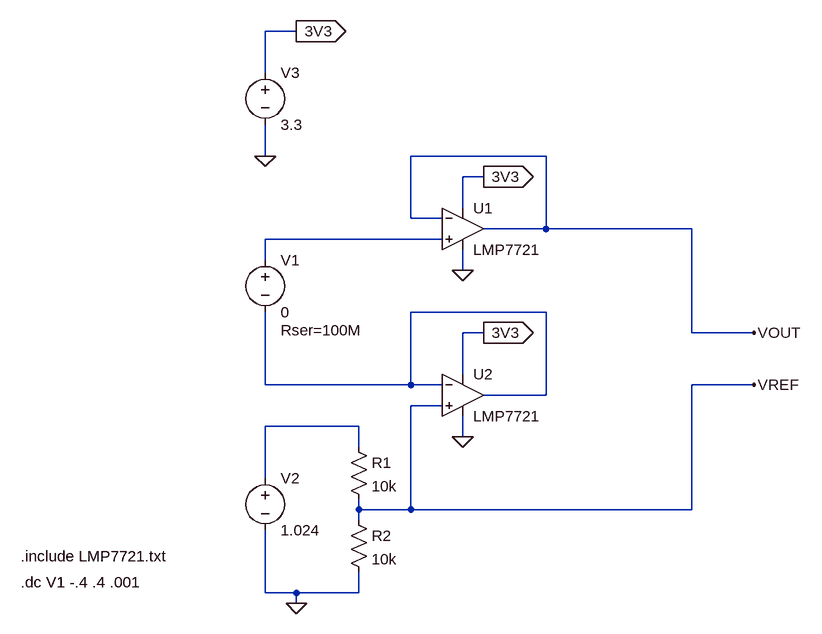
[diagram p0: schematic phMeter.asc]
phMeter.asc, the LTspice schematic file:
Version 4
SHEET 1 880 680
WIRE 48 -240 0 -240
WIRE 0 -176 0 -240
WIRE 0 -48 0 -96
WIRE 432 -48 224 -48
WIRE 336 -16 304 -16
WIRE 304 32 304 -16
WIRE 224 48 224 -48
WIRE 272 48 224 48
WIRE 432 64 432 -48
WIRE 432 64 336 64
WIRE 656 64 432 64
WIRE 272 80 0 80
WIRE 0 112 0 80
WIRE 304 128 304 96
WIRE 432 192 224 192
WIRE 336 224 304 224
WIRE 656 224 656 64
WIRE 752 224 656 224
WIRE 304 288 304 224
WIRE 0 304 0 192
WIRE 224 304 224 192
WIRE 224 304 0 304
WIRE 272 304 224 304
WIRE 752 304 656 304
WIRE 432 320 432 192
WIRE 432 320 336 320
WIRE 272 336 224 336
WIRE 144 368 0 368
WIRE 304 384 304 352
WIRE 144 400 144 368
WIRE 0 448 0 368
WIRE 144 496 144 480
WIRE 224 496 224 336
WIRE 224 496 144 496
WIRE 656 496 656 304
WIRE 656 496 224 496
WIRE 144 512 144 496
WIRE 0 624 0 528
WIRE 48 624 0 624
WIRE 144 624 144 592
WIRE 144 624 48 624
WIRE 48 640 48 624
FLAG 304 128 0
FLAG 304 384 0
FLAG 336 224 3V3
IOPIN 336 224 Out
FLAG 336 -16 3V3
IOPIN 336 -16 Out
FLAG 48 640 0
FLAG 0 -48 0
FLAG 48 -240 3V3
IOPIN 48 -240 Out
FLAG 752 224 VOUT
FLAG 752 304 VREF
SYMBOL voltage 0 96 R0
WINDOW 123 0 0 Left 0
WINDOW 39 24 124 Left 2
SYMATTR InstName V1
SYMATTR Value 0
SYMATTR SpiceLine Rser=100M
SYMBOL Opamps\\opamp2 304 0 R0
SYMATTR InstName U1
SYMATTR Value LMP7721
SYMBOL Opamps\\opamp2 304 256 R0
SYMATTR InstName U2
SYMATTR Value LMP7721
SYMBOL voltage 0 432 R0
WINDOW 123 0 0 Left 0
WINDOW 39 0 0 Left 0
SYMATTR InstName V2
SYMATTR Value 1.024
SYMBOL voltage 0 -192 R0
WINDOW 123 0 0 Left 0
WINDOW 39 0 0 Left 0
SYMATTR InstName V3
SYMATTR Value 3.3
SYMBOL res 128 384 R0
SYMATTR InstName R1
SYMATTR Value 10k
SYMBOL res 128 496 R0
SYMATTR InstName R2
SYMATTR Value 10k
TEXT -376 568 Left 2 !.include LMP7721.txt
TEXT -376 608 Left 2 !.dc V1 -.4 .4 .001

The netlist it stands for:
* phMeter.asc
V1 N001 N002 0 Rser=100M
XU1 N001 VOUT 3V3 0 VOUT LMP7721  ; pins In+ In- V+ V- OUT
XU2 VREF N002 3V3 0 N002 LMP7721  ; pins In+ In- V+ V- OUT
V2 N003 0 1.024
V3 3V3 0 3.3
R1 N003 VREF 10k
R2 VREF 0 10k
.include LMP7721.txt
.dc V1 -.4 .4 .001
.backanno
.end